# Altium project zyf_lcd.PrjPCB
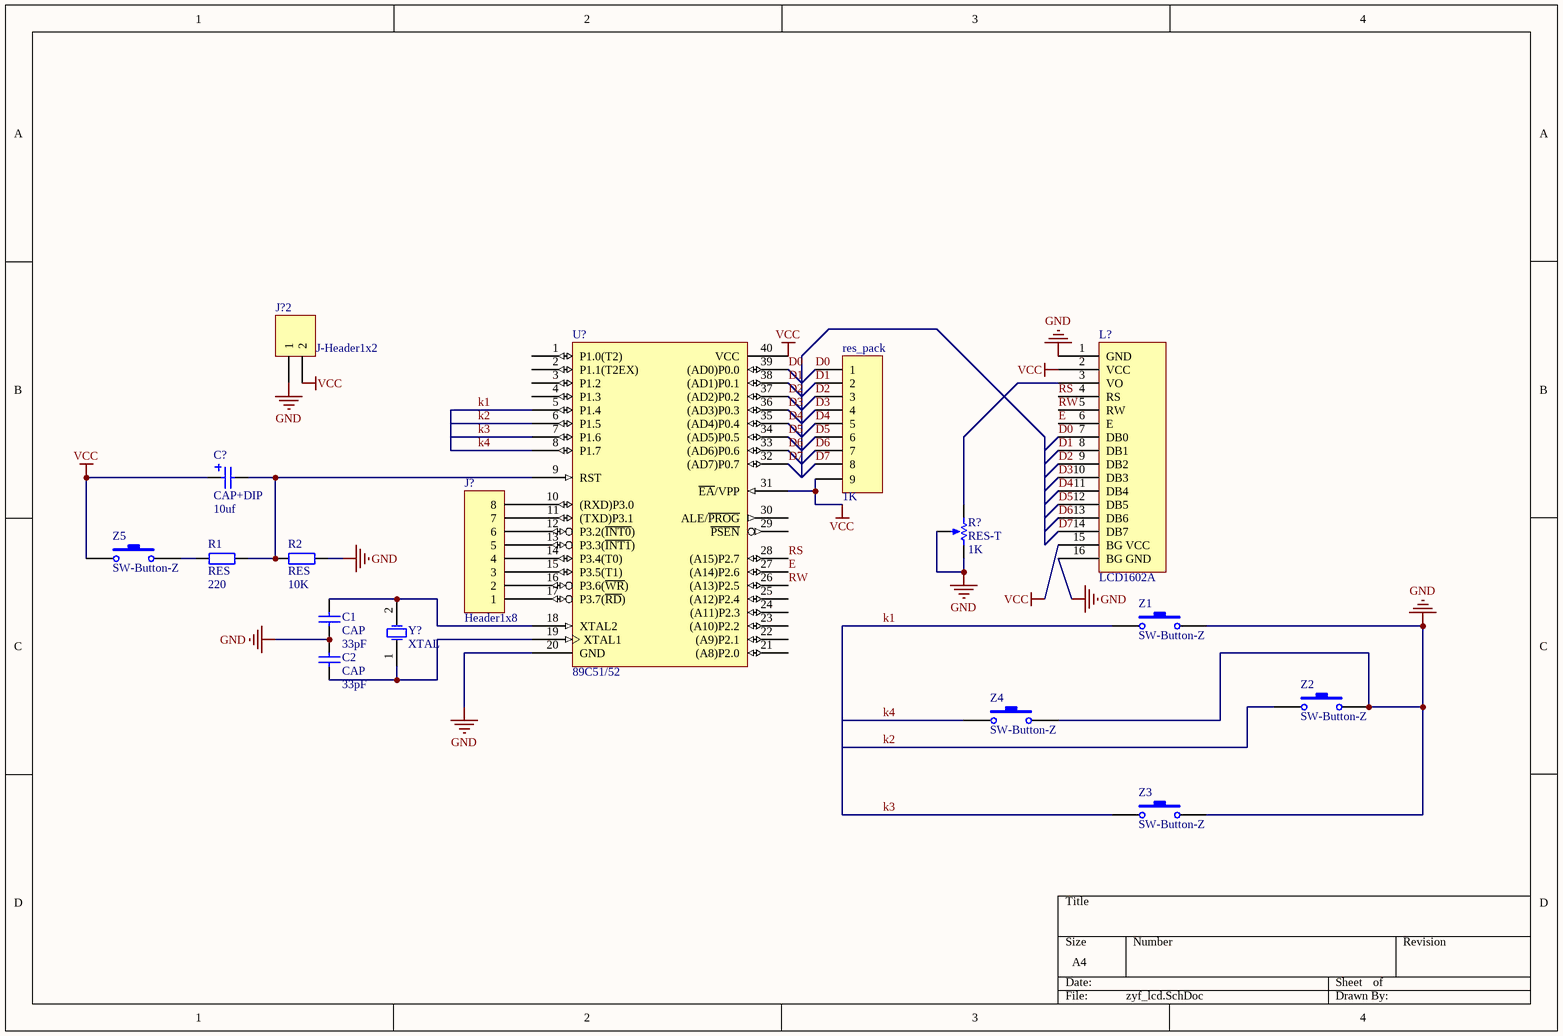
[diagram p0: zyf_lcd.SchDoc]
1 sheet, 17 parts. Net scope: global (net labels, ports and power ports of the same name join across sheets).
Board file: zyf_lcd.PcbDoc

## Sheet zyf_lcd.SchDoc
size A4

### Parts
C1  CAP  [CAP]
C2  CAP  [CAP]
C?  CAP+DIP  [CAP+DIP]
J?  Header1x8  [HEADER1X8]
J?2  J-Header1x2  [J-HEADER1X2]
L?  LCD1602A  [LCD1602A]
R1  RES  [RES]
R2  RES  [RES]
R?  RES-T  [RES-Change-T]
res_pack  1K  [HEADER1X9]
U?  89C51/52  [DIP-40]
Y?  XTAL  [XTAL]
Z1  SW-Button-Z  [SW-PB-Z]
Z2  SW-Button-Z  [SW-PB-Z]
Z3  SW-Button-Z  [SW-PB-Z]
Z4  SW-Button-Z  [SW-PB-Z]
Z5  SW-Button-Z  [SW-PB-Z]

### Nets
GND: C1.1 C2.2 J?2.1 L?.1(GND) L?.16(BG_GND) R2.2 R?.2(BOT) R?.3(TAP) U?.20(GND) Z1.2 Z2.2 Z3.2 Z4.2
VCC: C?.1 J?2.2 L?.2(VCC) L?.15(BG_VCC) res_pack.9 U?.31(~{EA}/VPP) U?.40(VCC) Z5.1
D0: L?.7(DB0) res_pack.1 U?.39((AD0)P0.0)
D1: L?.8(DB1) res_pack.2 U?.38((AD1)P0.1)
D2: L?.9(DB2) res_pack.3 U?.37((AD2)P0.2)
D3: L?.10(DB3) res_pack.4 U?.36((AD3)P0.3)
D4: L?.11(DB4) res_pack.5 U?.35((AD4)P0.4)
D5: L?.12(DB5) res_pack.6 U?.34((AD5)P0.5)
D6: L?.13(DB6) res_pack.7 U?.33((AD6)P0.6)
D7: L?.14(DB7) res_pack.8 U?.32((AD7)P0.7)
E: L?.6(E) U?.27((A14)P2.6)
k1: U?.5(P1.4) Z1.1
k2: U?.6(P1.5) Z2.1
k3: U?.7(P1.6) Z3.1
k4: U?.8(P1.7) Z4.1
RS: L?.4(RS) U?.28((A15)P2.7)
RW: L?.5(RW) U?.26((A13)P2.5)
NetC1_2: C1.2 U?.18(XTAL2) Y?.2(OSC2)
NetC2_1: C2.1 U?.19(XTAL1) Y?.1(OSC1)
NetC?_2: C?.2 R1.2 R2.1 U?.9(RST)
NetJ?_1: J?.1 U?.17(P3.7(~{RD}))
NetJ?_2: J?.2 U?.16(P3.6(~{WR}))
NetJ?_3: J?.3 U?.15(P3.5(T1))
NetJ?_4: J?.4 U?.14(P3.4(T0))
NetJ?_5: J?.5 U?.13(P3.3(~{INT1}))
NetJ?_6: J?.6 U?.12(P3.2(~{INT0}))
NetJ?_7: J?.7 U?.11((TXD)P3.1)
NetJ?_8: J?.8 U?.10((RXD)P3.0)
NetL?_3: L?.3(VO) R?.1(TOP)
NetR1_1: R1.1 Z5.2

Not connected (* = marked no-connect by the designer): U? 1(P1.0(T2)) 2(P1.1(T2EX)) 3(P1.2) 4(P1.3) 21((A8)P2.0) 22((A9)P2.1) 23((A10)P2.2) 24((A11)P2.3) 25((A12)P2.4) 29(~{PSEN}) 30(ALE/~{PROG})

### Notes on the sheet
- (in symbol CAP) 33pF
- (in symbol CAP+DIP) 10uf
- (in symbol RES) 220; 10K
- (in symbol RES-Change-T) 1K

### Library data of the parts
R? = RES-Change-T
res_pack = Header1x9